# Altium project processor_project.PrjPCB
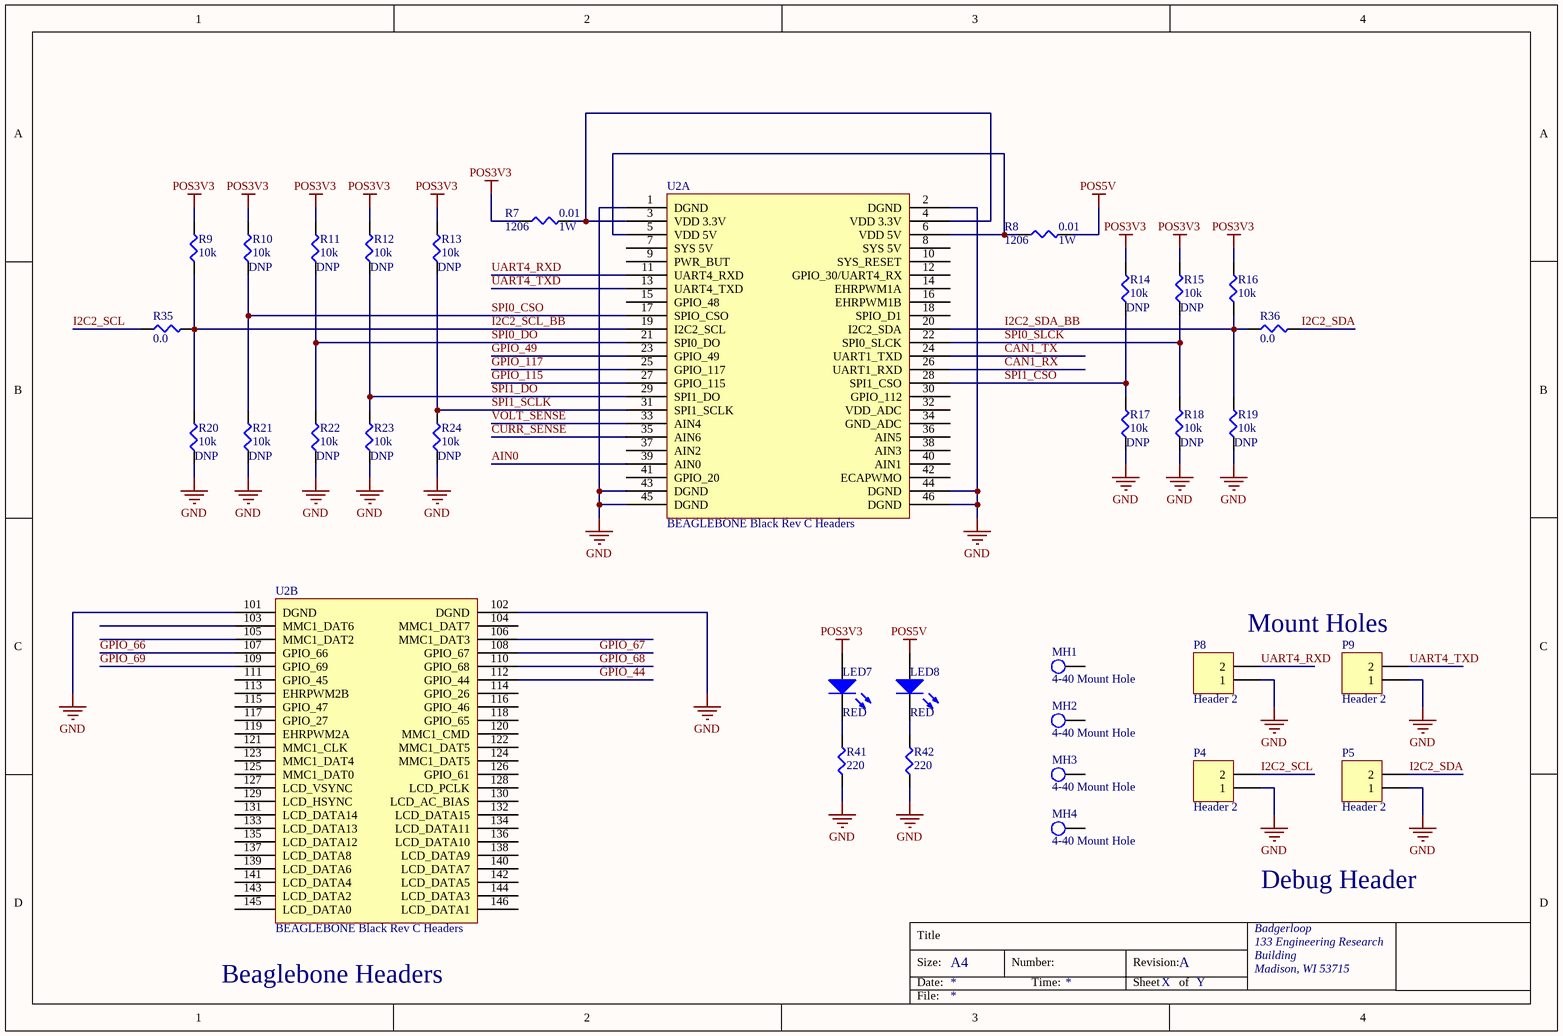
[diagram p0: processor_beaglebone.SchDoc]
Designer: R. Castle; Engineer: R. Castle; Part_Number: P4_LV_Processor; Revision: A
3 sheets, 55 parts. Net scope: global (net labels, ports and power ports of the same name join across sheets).
Board file: processor_pcb.PcbDoc
Sheets:
  processor_beaglebone.SchDoc
  processor_breakout_conn.SchDoc
  processor_main_connector.SchDoc

## Sheet processor_beaglebone.SchDoc
size A4; Organization: Badgerloop; Address1: 133 Engineering Research; Address2: Building; Address3: Madison, WI 53715; SheetNumber: X; SheetTotal: Y

### Parts
LED7  RED  [LED 0603 RED]
LED8  RED  [LED 0603 RED]
MH1  4-40 Mount Hole  [MH]
MH2  4-40 Mount Hole  [MH]
MH3  4-40 Mount Hole  [MH]
MH4  4-40 Mount Hole  [MH]
P4  Header 2  [Pin Header 1x2 TH Pitch 2.54mm]
P5  Header 2  [Pin Header 1x2 TH Pitch 2.54mm]
P8  Header 2  [Pin Header 1x2 TH Pitch 2.54mm]
P9  Header 2  [Pin Header 1x2 TH Pitch 2.54mm]
R7  0.01  Power (Watts): 1W  Supplier Device Package: 1206  [SMD-1206-RES]
R8  0.01  Power (Watts): 1W  Supplier Device Package: 1206  [SMD-1206-RES]
R9  10k  [SMD-0402-RES]
R10  10k  [SMD-0402-RES]
R11  10k  [SMD-0402-RES]
R12  10k  [SMD-0402-RES]
R13  10k  [SMD-0402-RES]
R14  10k  [SMD-0402-RES]
R15  10k  [SMD-0402-RES]
R16  10k  [SMD-0402-RES]
R17  10k  [SMD-0402-RES]
R18  10k  [SMD-0402-RES]
R19  10k  [SMD-0402-RES]
R20  10k  [SMD-0402-RES]
R21  10k  [SMD-0402-RES]
R22  10k  [SMD-0402-RES]
R23  10k  [SMD-0402-RES]
R24  10k  [SMD-0402-RES]
R35  0.0  [SMD-0402-RES]
R36  0.0  [SMD-0402-RES]
R41  220  [SMD-0805-RES]
R42  220  [SMD-0805-RES]
U2  BEAGLEBONE Black Rev C Headers  [Beaglebone_Topside]  (parts A,B of 2)

### Nets
GND: P4.1 P5.1 P8.1 P9.1 R17.1 R18.1 R19.1 R20.1 R21.1 R22.1 R23.1 R24.1 R41.1 R42.1 U2.1(DGND) U2.2(DGND) U2.43(DGND) U2.44(DGND) U2.45(DGND) U2.46(DGND) U2.101(DGND) U2.102(DGND)
POS3V3: LED7.1(A) R7.1 R9.2 R10.2 R11.2 R12.2 R13.2 R14.2 R15.2 R16.2
POS5V: LED8.1(A) R8.2
AIN0: U2.39(AIN0)
CAN1_RX: U2.26(UART1_RXD)
CAN1_TX: U2.24(UART1_TXD)
CURR_SENSE: U2.35(AIN6)
GPIO_44: U2.112(GPIO_44)
GPIO_49: U2.23(GPIO_49)
GPIO_66: U2.107(GPIO_66)
GPIO_67: U2.108(GPIO_67)
GPIO_68: U2.110(GPIO_68)
GPIO_69: U2.109(GPIO_69)
GPIO_115: U2.27(GPIO_115)
GPIO_117: U2.25(GPIO_117)
I2C2_SCL: P4.2 R35.1
I2C2_SCL_BB: R9.1 R20.2 R35.2 U2.19(I2C2_SCL)
I2C2_SDA: P5.2 R36.2
I2C2_SDA_BB: R16.1 R19.2 R36.1 U2.20(I2C2_SDA)
SPI0_CSO: R10.1 R21.2 U2.17(SPIO_CSO)
SPI0_DO: R11.1 R22.2 U2.21(SPI0_DO)
SPI0_SLCK: R15.1 R18.2 U2.22(SPI0_SLCK)
SPI1_CSO: R14.1 R17.2 U2.28(SPI1_CSO)
SPI1_DO: R12.1 R23.2 U2.29(SPI1_DO)
SPI1_SCLK: R13.1 R24.2 U2.31(SPI1_SCLK)
UART4_RXD: P8.2 U2.11(UART4_RXD)
UART4_TXD: P9.2 U2.13(UART4_TXD)
VOLT_SENSE: U2.33(AIN4)
NetLED7_2: LED7.2(K) R41.2
NetLED8_2: LED8.2(K) R42.2
NetR7_2: R7.2 U2.3(VDD_3.3V) U2.4(VDD_3.3V)
NetR8_1: R8.1 U2.5(VDD_5V) U2.6(VDD_5V)

Not connected (* = marked no-connect by the designer): MH1 46; MH2 46; MH3 46; MH4 46; U2 7(SYS_5V) 8(SYS_5V) 9(PWR_BUT) 10(SYS_RESET) 12(GPIO_30/UART4_RX) 14(EHRPWM1A) 15(GPIO_48) 16(EHRPWM1B) 18(SPIO_D1) 30(GPIO_112) 32(VDD_ADC) 34(GND_ADC) 36(AIN5) 37(AIN2) 38(AIN3) 40(AIN1) 41(GPIO_20) 42(ECAPWMO) 103(MMC1_DAT6) 104(MMC1_DAT7) 105(MMC1_DAT2) 106(MMC1_DAT3) 111(GPIO_45) 113(EHRPWM2B) 114(GPIO_26) 115(GPIO_47) 116(GPIO_46) 117(GPIO_27) 118(GPIO_65) 119(EHRPWM2A) 120(MMC1_CMD) 121(MMC1_CLK) 122(MMC1_DAT5) 123(MMC1_DAT4) 124(MMC1_DAT5) 125(MMC1_DAT0) 126(GPIO_61) 127(LCD_VSYNC) 128(LCD_PCLK) 129(LCD_HSYNC) 130(LCD_AC_BIAS) 131(LCD_DATA14) 132(LCD_DATA15) 133(LCD_DATA13) 134(LCD_DATA11) 135(LCD_DATA12) 136(LCD_DATA10) 137(LCD_DATA8) 138(LCD_DATA9) 139(LCD_DATA6) 140(LCD_DATA7) 141(LCD_DATA4) 142(LCD_DATA5) 143(LCD_DATA2) 144(LCD_DATA3) 145(LCD_DATA0) 146(LCD_DATA1)

### Notes on the sheet
- Mount Holes
- Debug Header
- (near U2) Beaglebone Headers
- Title
- Size:
- Date:
- A4
- Number:
- Time:
- Revision:
- Sheet
- of
- File:

### Library data of the parts
LED7 LED8 = LED RED 0603: Red 631nm LED Indication - Discrete 2V 0603 (1608 Metric); Manufacturer: Lite-On Inc.; Manufacturer P/N: LTST-C190KRKT; Digikey P/N: 160-1436-1-ND; Package / Case: 0603; Color: RED
P4 P5 P8 P9 = Header 2: Header, 2-Pin; LatestRevisionDate: 17-Jul-2002; LatestRevisionNote: Re-released for DXP Platform.; Publisher: Altium Limited
R7 R8 = ERJ-8CWFR010V: RES SMD 0.01 OHM 1% 1W 1206; Manufacturer: Panasonic Electronic Components; Factory Stock: 0; Unit Price (USD): 0.12302; @ qty: 1500; Minimum Quantity: 1; Temperature Coefficient: ±75ppm/°C; Part Number: ERJ-8CWFR010V; Datasheets: https://industrial.panasonic.com/cdbs/www-data/pdf/RDA0000/AOA0000C239.pdf; Image: //media.digikey.com/Renders/Panasonic%20Renders/ERJ-1206%20Pkg.jpg; Digi-Key Part Number: P0.01BVCT-ND; Quantity Available: 2; Packaging: Cut Tape (CT); Series: ERJ; Part Status: Active; Value: 0.01; Tolerance: ±1%; Composition: Thick Film; Features: Automotive AEC-Q200, Current Sense; Operating Temperature: -55°C ~ 155°C; Package / Case: 1206 (3216 Metric); Size / Dimension: 0.126" L x 0.063" W (3.20mm x 1.60mm); Height - Seated (Max): 0.030" (0.75mm); Number of Terminations: 2; Failure Rate: -
R9-R24 = ERJ-2GEJ103X: RES SMD 10K OHM 5% 1/10W 0402; Manufacturer: Panasonic Electronic Components; Factory Stock: 0; Unit Price (USD): 0.00350; @ qty: 1500; Minimum Quantity: 1; Power (Watts): 0.1W, 1/10W; Temperature Coefficient: ±200ppm/°C; Part Number: ERJ-2GEJ103X; Datasheets: http://industrial.panasonic.com/www-cgi/jvcr13pz.cgi?E+PZ+3+AOA0001+ERJ2GEJ103X+7+WW; Image: //media.digikey.com/Photos/Panasonic%20Photos/ERJ-PA2-Series.jpg; Digi-Key Part Number: P10KJCT-ND; Quantity Available: 2560215; Packaging: Cut Tape (CT); Series: ERJ; Part Status: Active; Value: 10k; Tolerance: ±5%; Composition: Thick Film; Features: Automotive AEC-Q200; Operating Temperature: -55°C ~ 155°C; Package / Case: 0402 (1005 Metric); Supplier Device Package: 0402; Size / Dimension: 0.039" L x 0.020" W (1.00mm x 0.50mm); Height - Seated (Max): 0.016" (0.40mm); Number of Terminations: 2; Failure Rate: -
  R10-R15 R17-R24: DNP: DNP
R35 R36 = ERJ-2GE0R00X: RES SMD 0.0OHM JUMPER 1/10W 0402; Manufacturer: Panasonic Electronic Components; Factory Stock: 0; Unit Price (USD): 0.00384; @ qty: 1500; Minimum Quantity: 1; Power (Watts): 0.1W, 1/10W; Part Number: ERJ-2GE0R00X; Datasheets: http://industrial.panasonic.com/www-cgi/jvcr13pz.cgi?E+PZ+3+AOA0001+ERJ2GE0R00X+7+WW; Image: //media.digikey.com/Photos/Panasonic%20Photos/ERJ-PA2-Series.jpg; Digi-Key Part Number: P0.0JCT-ND; Quantity Available: 3152483; Packaging: Cut Tape (CT); Series: ERJ; Part Status: Active; Value: 0.0; Tolerance: Jumper; Composition: Thick Film; Features: Automotive AEC-Q200; Temperature Coefficient: -; Operating Temperature: -55°C ~ 155°C; Package / Case: 0402 (1005 Metric); Supplier Device Package: 0402; Size / Dimension: 0.039" L x 0.020" W (1.00mm x 0.50mm); Height - Seated (Max): 0.016" (0.40mm); Number of Terminations: 2; Failure Rate: -
R41 R42 = ERJ-6ENF2200V: RES SMD 220 OHM 1% 1/8W 0805; Manufacturer: Panasonic Electronic Components; Factory Stock: 0; Unit Price (USD): 0.00729; @ qty: 1500; Minimum Quantity: 1; Power (Watts): 0.125W, 1/8W; Temperature Coefficient: ±100ppm/°C; Part Number: ERJ-6ENF2200V; Datasheets: http://industrial.panasonic.com/www-cgi/jvcr13pz.cgi?E+PZ+3+AOA0002+ERJ6ENF2200V+7+WW; Image: //media.digikey.com/Renders/Panasonic%20Renders/ERJ-0805%20Pkg.jpg; Digi-Key Part Number: P220CCT-ND; Quantity Available: 111570; Packaging: Cut Tape (CT); Series: ERJ; Part Status: Active; Value: 220; Tolerance: ±1%; Composition: Thick Film; Features: Automotive AEC-Q200; Operating Temperature: -55°C ~ 155°C; Package / Case: 0805 (2012 Metric); Supplier Device Package: 0805; Size / Dimension: 0.079" L x 0.049" W (2.00mm x 1.25mm); Height - Seated (Max): 0.028" (0.70mm); Number of Terminations: 2; Failure Rate: -
U2 = Beaglebone: Beaglebone Black Rev C Header

## Sheet processor_breakout_conn.SchDoc
size A4; Organization: Badgerloop; Address1: 133 Engineering Research; Address2: Building; Address3: Madison, WI 53715; SheetNumber: X; SheetTotal: Y
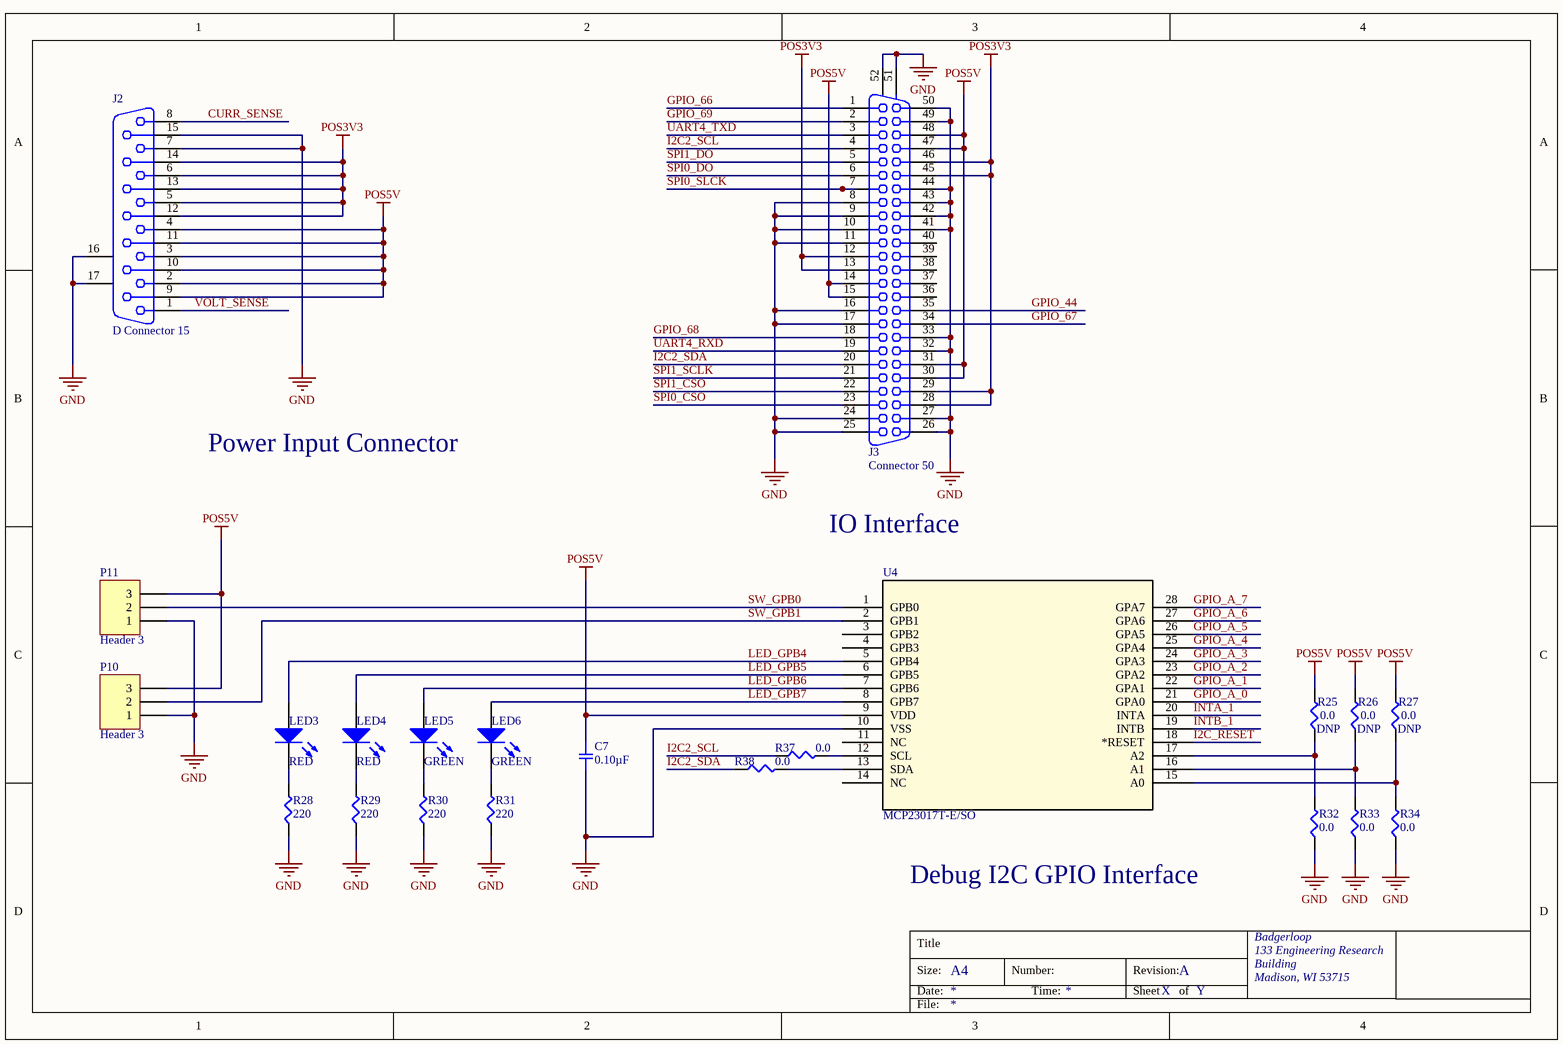
[diagram p1: processor_breakout_conn.SchDoc]

### Parts
C7  0.10µF  [SMD-0603C]
J2  D Connector 15  [DSUB1.385-2H15]
J3  Connector 50  [050DSUB1.27-H96]
LED3  RED  [LED 0603 RED]
LED4  RED  [LED 0603 RED]
LED5  GREEN  [LED 0603 GREEN]
LED6  GREEN  [LED 0603 GREEN]
P10  Header 3  [Pin Header 1x3 TH Pitch 2.54mm]
P11  Header 3  [Pin Header 1x3 TH Pitch 2.54mm]
R25  0.0  [SMD-0402-RES]
R26  0.0  [SMD-0402-RES]
R27  0.0  [SMD-0402-RES]
R28  220  [SMD-0805-RES]
R29  220  [SMD-0805-RES]
R30  220  [SMD-0805-RES]
R31  220  [SMD-0805-RES]
R32  0.0  [SMD-0402-RES]
R33  0.0  [SMD-0402-RES]
R34  0.0  [SMD-0402-RES]
R37  0.0  [SMD-0402-RES]
R38  0.0  [SMD-0402-RES]
U4  MCP23017T-E/SO  [SOIC28-W_MC-M]

### Nets
GND: C7.2 J2.7 J2.15 J2.16(MH1) J2.17(MH2) J3.8 J3.9 J3.10 J3.11 J3.16 J3.17 J3.24 J3.25 J3.26 J3.27 J3.32 J3.33 J3.41 J3.42 J3.43 J3.44 J3.49 J3.50 J3.51 J3.52 P10.1 P11.1 R28.1 R29.1 R30.1 R31.1 R32.1 R33.1 R34.1 U4.10(VSS)
POS3V3: J2.5 J2.6 J2.12 J2.13 J2.14 J3.12 J3.13 J3.28 J3.29 J3.45 J3.46
POS5V: C7.1 J2.2 J2.3 J2.4 J2.9 J2.10 J2.11 J3.14 J3.15 J3.30 J3.31 J3.47 J3.48 P10.3 P11.3 R25.2 R26.2 R27.2 U4.9(VDD)
CURR_SENSE: J2.8
GPIO_44: J3.35
GPIO_66: J3.1
GPIO_67: J3.34
GPIO_68: J3.18
GPIO_69: J3.2
GPIO_A_0: U4.21(GPA0)
GPIO_A_1: U4.22(GPA1)
GPIO_A_2: U4.23(GPA2)
GPIO_A_3: U4.24(GPA3)
GPIO_A_4: U4.25(GPA4)
GPIO_A_5: U4.26(GPA5)
GPIO_A_6: U4.27(GPA6)
GPIO_A_7: U4.28(GPA7)
I2C2_SCL: J3.4 R37.1
I2C2_SDA: J3.20 R38.1
I2C_RESET: U4.18(*RESET)
INTA_1: U4.20(INTA)
INTB_1: U4.19(INTB)
LED_GPB4: LED3.1(A) U4.5(GPB4)
LED_GPB5: LED4.1(A) U4.6(GPB5)
LED_GPB6: LED5.1(A) U4.7(GPB6)
LED_GPB7: LED6.1(A) U4.8(GPB7)
SPI0_CSO: J3.23
SPI0_DO: J3.6
SPI0_SLCK: J3.7
SPI1_CSO: J3.22
SPI1_DO: J3.5
SPI1_SCLK: J3.21
SW_GPB0: P11.2 U4.1(GPB0)
SW_GPB1: P10.2 U4.2(GPB1)
UART4_RXD: J3.19
UART4_TXD: J3.3
VOLT_SENSE: J2.1
NetLED3_2: LED3.2(K) R28.2
NetLED4_2: LED4.2(K) R29.2
NetLED5_2: LED5.2(K) R30.2
NetLED6_2: LED6.2(K) R31.2
NetR25_1: R25.1 R32.2 U4.17(A2)
NetR26_1: R26.1 R33.2 U4.16(A1)
NetR27_1: R27.1 R34.2 U4.15(A0)
NetR37_2: R37.2 U4.12(SCL)
NetR38_2: R38.2 U4.13(SDA)

Not connected (* = marked no-connect by the designer): J3 36 37 38 39 40; U4 3(GPB2) 4(GPB3) 11(NC) 14(NC)

### Notes on the sheet
- Power Input Connector
- IO Interface
- Debug I2C GPIO Interface
- Title
- Size:
- Date:
- A4
- Number:
- Time:
- Revision:
- Sheet
- of
- File:

### Library data of the parts
C7 = GCJ188R72A104KA01D: CAP CER 0.1UF 100V X7R 0603; Manufacturer: Murata Electronics North America; Factory Stock: 0; Unit Price (USD): 0.23; Minimum Quantity: 1; Tolerance: ±10%; Datasheets: http://www.murata.com/~/media/webrenewal/support/library/catalog/products/capacitor/mlcc/c03e.ashx; Image: //media.digikey.com/Renders/Murata%20Renders/0603%28LQG18%29.jpg; Digi-Key Part Number: 490-13420-1-ND; Part Number: GCJ188R72A104KA01D; Quantity Available: 2728; @ qty: 0; Packaging: Cut Tape (CT); Series: GCJ; Part Status: Active; Value: 0.10µF; Voltage: 100V; Temperature Coefficient: X7R; Operating Temperature: -55°C ~ 125°C; Features: Soft Termination; Ratings: AEC-Q200; Applications: Automotive, Boardflex Sensitive; Mounting Type: Surface Mount, MLCC; Package / Case: 0603 (1608 Metric); Size / Dimension: 0.063" L x 0.031" W (1.60mm x 0.80mm); Height - Seated (Max): -; Thickness (Max): 0.035" (0.90mm); Lead Spacing: -; Lead Style: -
J2 = D Connector 15: Receptacle Assembly, 15 Position, Right Angle; PackageDocument: O; Positions: 15; Published: 15-Jun-2001; LatestRevisionDate: 17-Jul-2002; LatestRevisionNote: Re-released for DXP Platform.; DatasheetDocument: 1-Sep-99; PackageReference: 788757; Publisher: Altium Limited; Orientation: Right Angle; Gender: Receptacle
J3 = Connector 50: Receptacle Header Assemby; PackageDocument: B; Positions: 50; Published: 15-Jun-2001; LatestRevisionDate: 17-Jul-2002; LatestRevisionNote: Re-released for DXP Platform.; DatasheetDocument: 1-Oct-1983; PackageReference: 178240-7; Publisher: Altium Limited; Orientation: Right Angle
LED3 LED4 = LED RED 0603: as LED7 on sheet processor_beaglebone; Digikey P/N: 160-1436-1-ND; Package / Case: 0603; Color: RED
LED5 LED6 = LED GREEN 0603: Manufacturer: Lite-On Inc.; Manufacturer P/N: LTST-C190KGKT; Digikey P/N: 160-1435-1-ND; Package / Case: 0603; Color: GREEN
P10 P11 = Header 3: Header, 3-Pin; LatestRevisionDate: 17-Jul-2002; LatestRevisionNote: Re-released for DXP Platform.; Publisher: Altium Limited
R25-R27 R32-R34 R37 R38 = ERJ-2GE0R00X: as R35 on sheet processor_beaglebone; Part Number: ERJ-2GE0R00X; Datasheets: http://industrial.panasonic.com/www-cgi/jvcr13pz.cgi?E+PZ+3+AOA0001+ERJ2GE0R00X+7+WW; Image: //media.digikey.com/Photos/Panasonic%20Photos/ERJ-PA2-Series.jpg; Digi-Key Part Number: P0.0JCT-ND; Quantity Available: 3152483; Packaging: Cut Tape (CT); Series: ERJ; Part Status: Active; Value: 0.0; Tolerance: Jumper; Composition: Thick Film; Features: Automotive AEC-Q200; Temperature Coefficient: -; Operating Temperature: -55°C ~ 155°C; Package / Case: 0402 (1005 Metric); Supplier Device Package: 0402; Size / Dimension: 0.039" L x 0.020" W (1.00mm x 0.50mm); Height - Seated (Max): 0.016" (0.40mm); Number of Terminations: 2; Failure Rate: -
  R25-R27: DNP: DNP
  R32-R34: DNP: *
R28-R31 = ERJ-6ENF2200V: as R41 on sheet processor_beaglebone; Part Number: ERJ-6ENF2200V; Datasheets: http://industrial.panasonic.com/www-cgi/jvcr13pz.cgi?E+PZ+3+AOA0002+ERJ6ENF2200V+7+WW; Image: //media.digikey.com/Renders/Panasonic%20Renders/ERJ-0805%20Pkg.jpg; Digi-Key Part Number: P220CCT-ND; Quantity Available: 111570; Packaging: Cut Tape (CT); Series: ERJ; Part Status: Active; Value: 220; Tolerance: ±1%; Composition: Thick Film; Features: Automotive AEC-Q200; Operating Temperature: -55°C ~ 155°C; Package / Case: 0805 (2012 Metric); Supplier Device Package: 0805; Size / Dimension: 0.079" L x 0.049" W (2.00mm x 1.25mm); Height - Seated (Max): 0.028" (0.70mm); Number of Terminations: 2; Failure Rate: -
U4 = MCP23017T-E/SO: Imported; Vendor: Microchip; Built_By: EMA_UL_Team; C: Copyright (C) 2015 Accelerated Designs. All rights reserved; Manufacturer_Part_Number: MCP23017T-E/SO; RefDes: RefDes; Type: DEV; Value: Value

## Sheet processor_main_connector.SchDoc: processor_main_connector.schdoc
size A4; Organization: Badgerloop; Address1: 133 Engineering Research; Address2: Building; Address3: Madison, WI 53715; DocumentNumber: 1; Revision: A; SheetNumber: 2; SheetTotal: 2

### Notes on the sheet
- Title
- Size:
- Date:
- A4
- Number:
- Time:
- Revision:
- Sheet
- of
- File:

## Nets that join several sheets
GND: processor_beaglebone (22 pins), processor_breakout_conn (35 pins)
POS3V3: processor_beaglebone (10 pins), processor_breakout_conn (11 pins)
POS5V: processor_beaglebone (LED8.1 R8.2), processor_breakout_conn (19 pins)
CURR_SENSE: processor_beaglebone (U2.35), processor_breakout_conn (J2.8)
GPIO_44: processor_beaglebone (U2.112), processor_breakout_conn (J3.35)
GPIO_66: processor_beaglebone (U2.107), processor_breakout_conn (J3.1)
GPIO_67: processor_beaglebone (U2.108), processor_breakout_conn (J3.34)
GPIO_68: processor_beaglebone (U2.110), processor_breakout_conn (J3.18)
GPIO_69: processor_beaglebone (U2.109), processor_breakout_conn (J3.2)
I2C2_SCL: processor_beaglebone (P4.2 R35.1), processor_breakout_conn (J3.4 R37.1)
I2C2_SDA: processor_beaglebone (P5.2 R36.2), processor_breakout_conn (J3.20 R38.1)
SPI0_CSO: processor_beaglebone (R10.1 R21.2 U2.17), processor_breakout_conn (J3.23)
SPI0_DO: processor_beaglebone (R11.1 R22.2 U2.21), processor_breakout_conn (J3.6)
SPI0_SLCK: processor_beaglebone (R15.1 R18.2 U2.22), processor_breakout_conn (J3.7)
SPI1_CSO: processor_beaglebone (R14.1 R17.2 U2.28), processor_breakout_conn (J3.22)
SPI1_DO: processor_beaglebone (R12.1 R23.2 U2.29), processor_breakout_conn (J3.5)
SPI1_SCLK: processor_beaglebone (R13.1 R24.2 U2.31), processor_breakout_conn (J3.21)
UART4_RXD: processor_beaglebone (P8.2 U2.11), processor_breakout_conn (J3.19)
UART4_TXD: processor_beaglebone (P9.2 U2.13), processor_breakout_conn (J3.3)
VOLT_SENSE: processor_beaglebone (U2.33), processor_breakout_conn (J2.1)